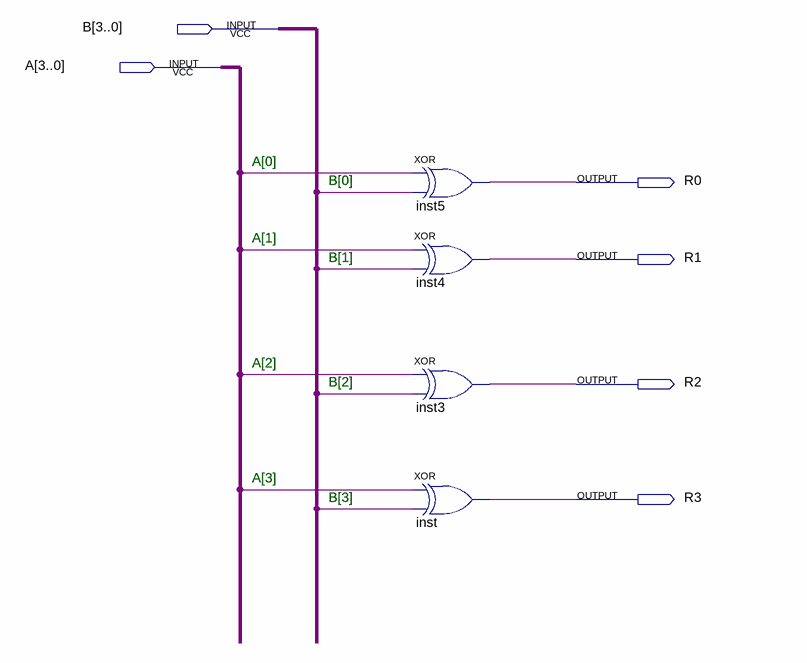
[diagram p0: schematic sheet]
// Quartus schematic ComXor.bdf as structural Verilog: 4 symbols, 6 pins
module ComXor (
  input  [3:0] B,
  input  [3:0] A,
  output R0,
  output R1,
  output R2,
  output R3
);

  xor inst5 (R0, A[0], B[0]);
  xor inst4 (R1, A[1], B[1]);
  xor inst3 (R2, A[2], B[2]);
  xor inst (R3, A[3], B[3]);

  // Notes on the sheet:
  //   A[0]
  //   B[0]
  //   A[1]
  //   B[1]
  //   A[2]
  //   B[2]
  //   A[3]
  //   B[3]
endmodule
